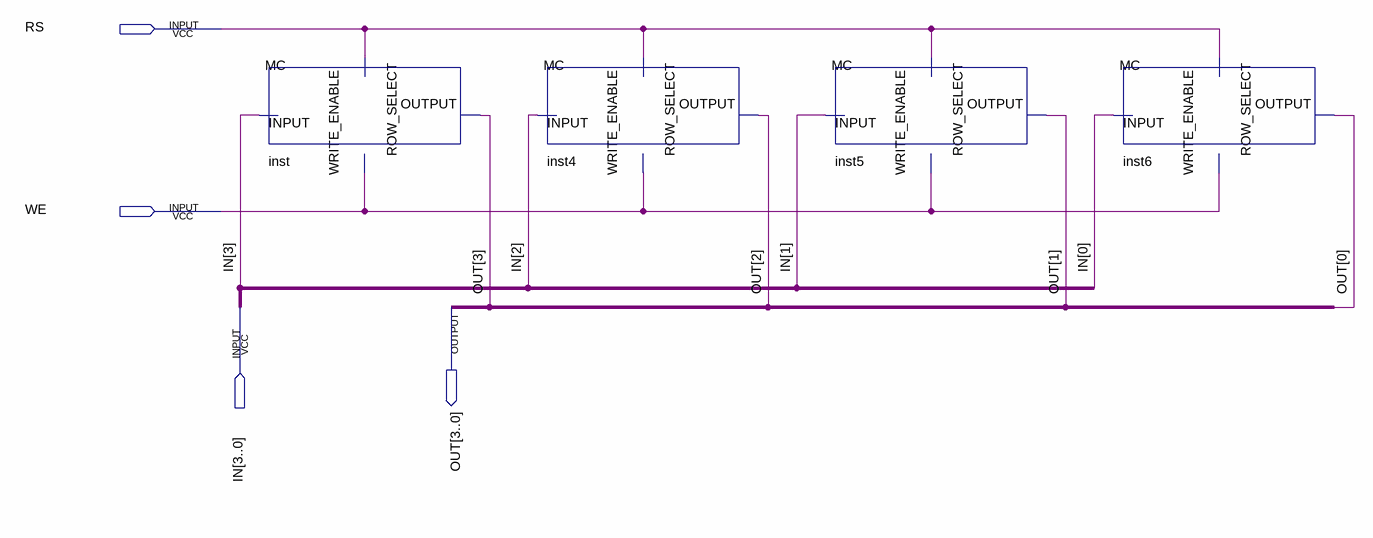
[diagram p0: schematic sheet]
// Quartus schematic MCx4.bdf as structural Verilog: 4 symbols, 4 pins
module MCx4 (
  input  RS,
  input  WE,
  input  [3:0] IN,
  output [3:0] OUT
);

  MC inst (.ROW_SELECT(RS), .INPUT(IN[3]), .WRITE_ENABLE(WE), .OUTPUT(OUT[3]));
  MC inst4 (.ROW_SELECT(RS), .INPUT(IN[2]), .WRITE_ENABLE(WE), .OUTPUT(OUT[2]));
  MC inst5 (.ROW_SELECT(RS), .INPUT(IN[1]), .WRITE_ENABLE(WE), .OUTPUT(OUT[1]));
  MC inst6 (.ROW_SELECT(RS), .INPUT(IN[0]), .WRITE_ENABLE(WE), .OUTPUT(OUT[0]));
endmodule
